# Altium project CSUEAF4.PrjPcb
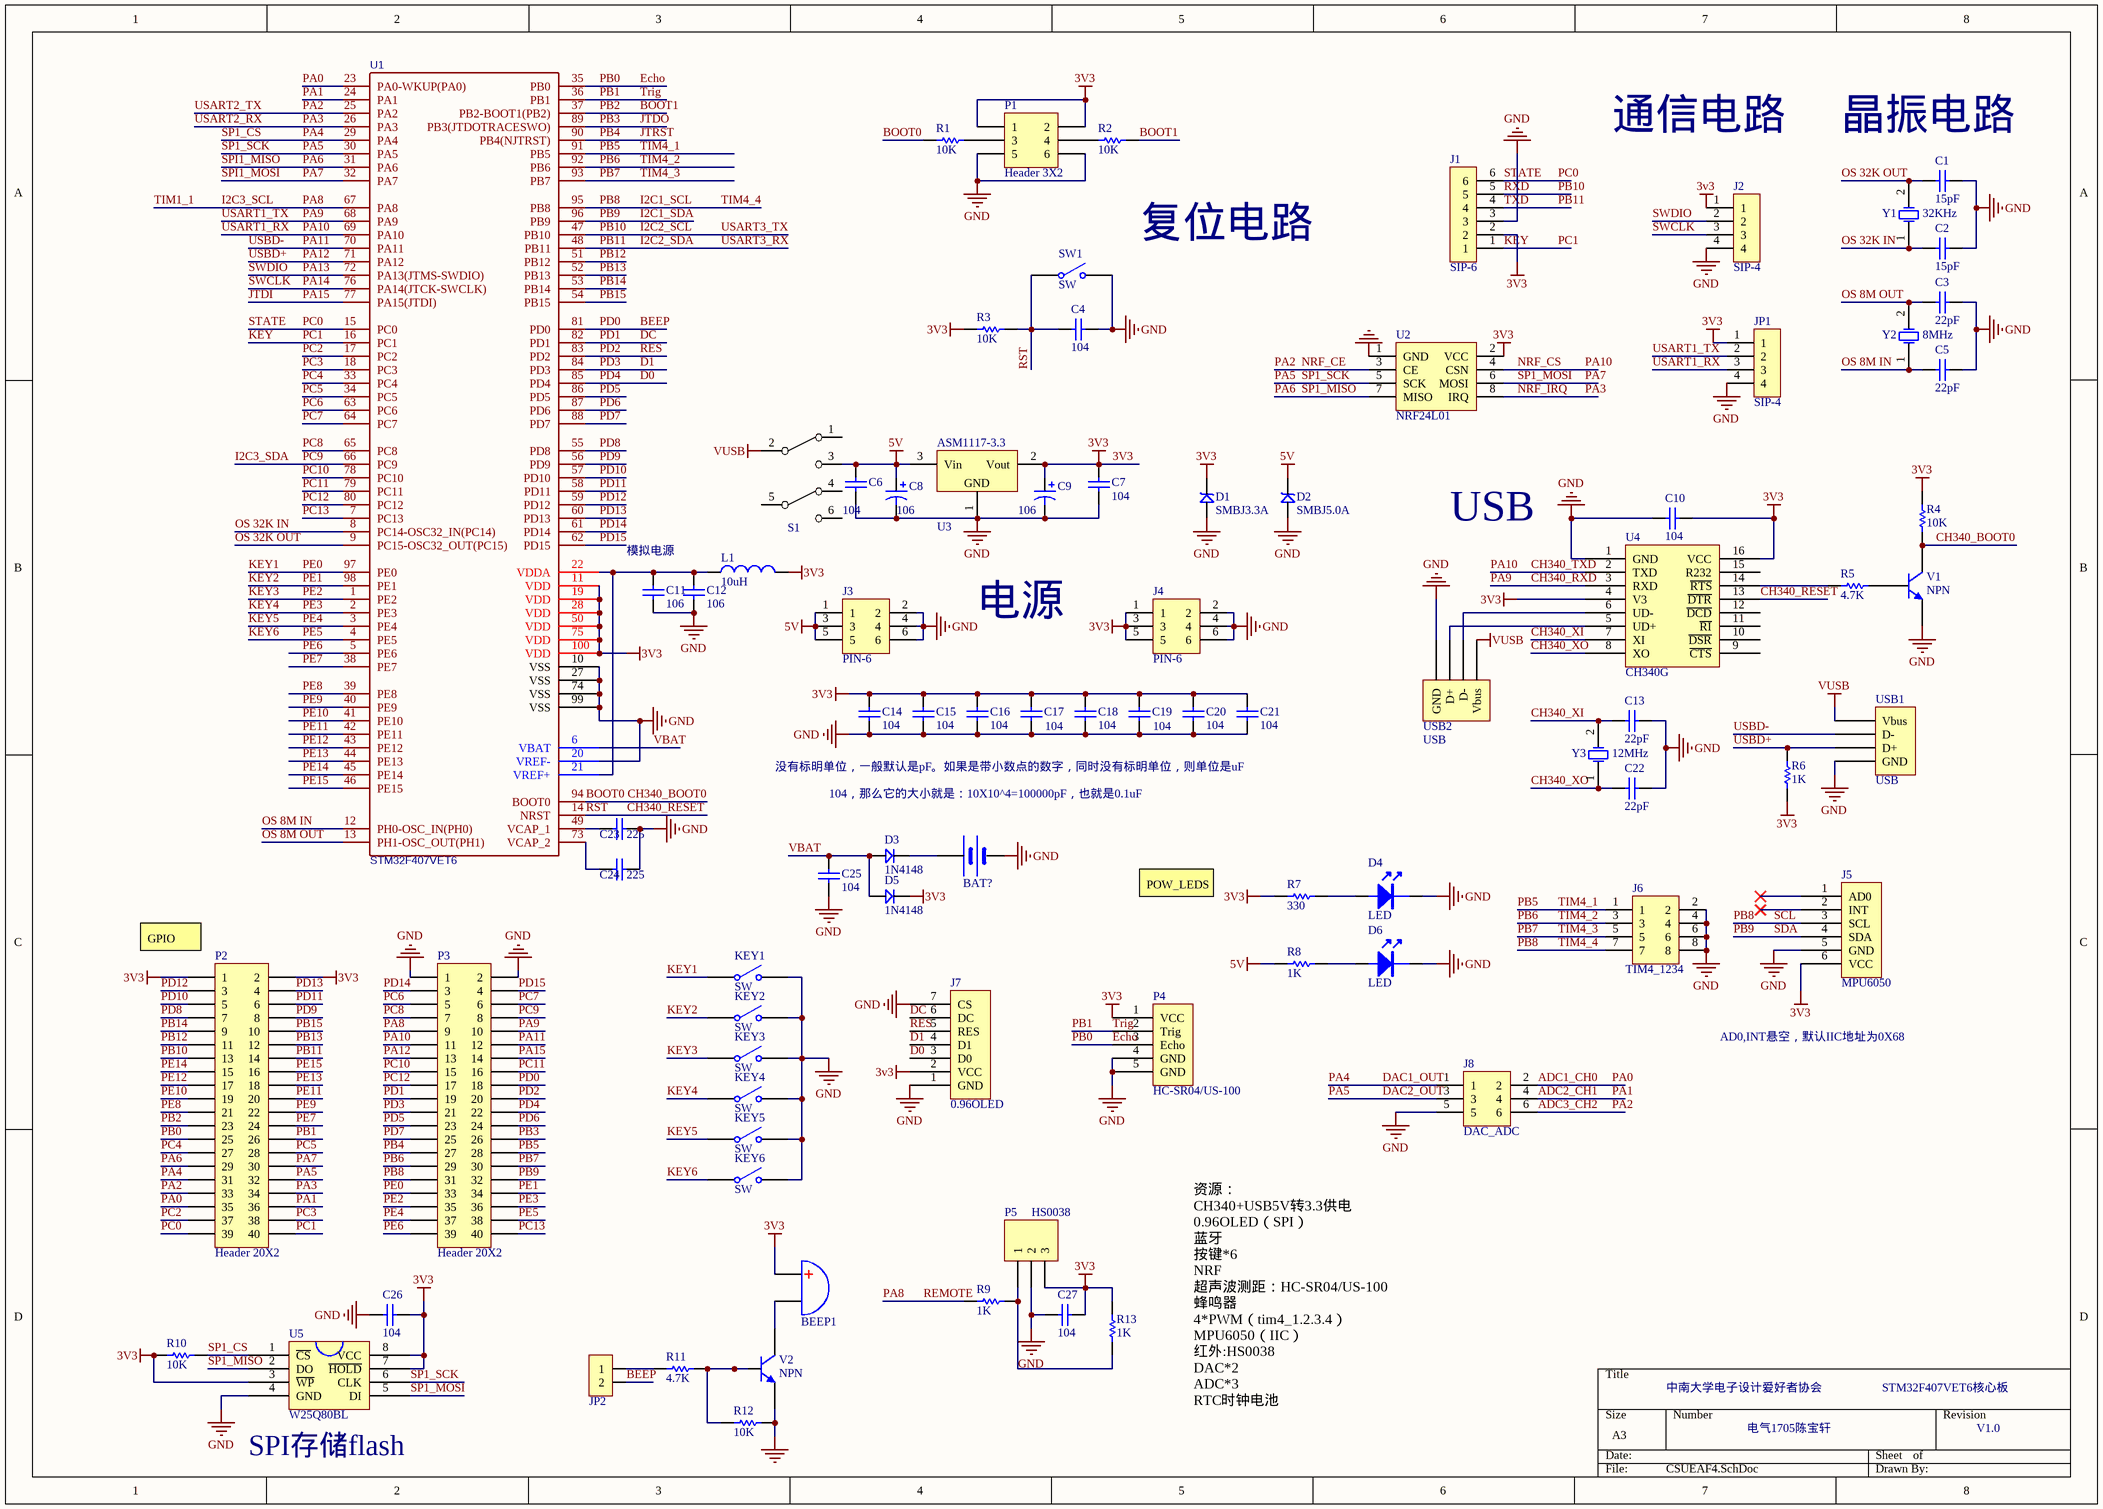
[diagram p0: CSUEAF4.SchDoc]
1 sheet, 84 parts. Net scope: global (net labels, ports and power ports of the same name join across sheets).
Board file: CSUEAF4.PcbDoc

## Sheet CSUEAF4.SchDoc
size A3

### Parts
BAT?  BATT  [BATM]  (value not drawn)
BEEP1  蜂鸣器  [蜂鸣器0905]  (value not drawn)
C1  15pF  [C0603]
C2  15pF  [C0603]
C3  22pF  [C0603]
C4  104  [C0603]
C5  22pF  [C0603]
C6  104  [C0603]
C7  104  [C0603]
C8  106  [3216-ce]
C9  106  [3216-ce]
C10  104  [C0603]
C11  106  [C0603]
C12  106  [C0603]
C13  22pF  [C0603]
C14  104  [C0603]
C15  104  [C0603]
C16  104  [C0603]
C17  104  [C0603]
C18  104  [C0603]
C19  104  [C0603]
C20  104  [C0603]
C21  104  [C0603]
C22  22pF  [C0603]
C23  225  [C0603]
C24  225  [C0603]
C25  104  [C0603]
C26  104  [C0603]
C27  104  [C0603]
D1  SMBJ3.3A  [SMBJ]
D2  SMBJ5.0A  [SMBJ]
D3  1N4148  [DO-35]
D4  LED  [LED 0603G]
D5  1N4148  [DO-35]
D6  LED  [LED 0603G]
J1  SIP-6  [2.54排针1X6]
J2  SIP-4  [2.54XH接插件4P]
J3  PIN-6  [2.54排针2X3]
J4  PIN-6  [2.54排针2X3]
J5  MPU6050  [2.54排针1X6]
J6  TIM4_1234  [2.54排针2X4]
J7  0.96OLED  [OLED 0.96-SPI _无定位孔]
J8  DAC_ADC  [2.54排针2X3]
JP1  SIP-4  [2.54排针1X4]
JP2  JX2  [SIP2]  (value not drawn)
KEY1  SW  [按键微动开关2]
KEY2  SW  [按键微动开关2]
KEY3  SW  [按键微动开关2]
KEY4  SW  [按键微动开关2]
KEY5  SW  [按键微动开关2]
KEY6  SW  [按键微动开关2]
L1  10uH  [L0603]
P1  Header 3X2  [HDR2X3]
P2  Header 20X2  [HDR2X20]
P3  Header 20X2  [HDR2X20]
P4  HC-SR04/US-100  [HDR1X5]
P5  HS0038  [HDR1X3]
R1  10K  [R0603]
R2  10K  [R0603]
R3  10K  [R0603]
R4  10K  [R0603]
R5  4.7K  [R0603]
R6  1K  [R0603]
R7  330  [R0603]
R8  1K  [R0603]
R9  1K  [R0603]
R10  10K  [R0603]
R11  4.7K  [R0603]
R12  10K  [R0603]
R13  1K  [R0603]
S1  SWITCH-6  [自锁开关5.8*5.8]  (value not drawn)
SW1  SW  [按键微动开关2]
U1  STM32F407VET6  [LQFP100]
U2  NRF24L01  [2.54排针2X4]
U3  AMS1117-3V3  [SOT223]  (value not drawn)
U4  CH340G  [SOIC16]
U5  W25Q80BL  [W25Q-SO8]
USB1  USB  [MICRO-USB-5P4脚无定位孔]
USB2  USB  [MICRO-USB-5P4脚无定位孔]
V1  NPN  [SOT-23]
V2  NPN  [SOT-23]
Y1  32KHz  [OSC-2x6-WI-B]
Y2  8MHz  [OSC-HC-49S]
Y3  12MHz  [OSC-HC-49S]

### Nets
3V3: BEEP1.1(A) C7.2 C9.1 C10.1 C14.2 C15.2 C16.2 C17.2 C18.2 C19.2 C20.2 C21.2 C26.1 C27.1 D1.2 D5.2 J1.2 J2.1 J4.1 J4.3 J4.5 J5.6(VCC) J7.2(VCC) JP1.1 L1.2 P1.1 P1.2 P2.1 P2.2 P4.1(VCC) P5.3 R3.1 R4.2 R6.1 R7.2 R10.2 R13.1 U1.11(VDD) U1.19(VDD) U1.28(VDD) U1.50(VDD) U1.75(VDD) U1.100(VDD) U2.2(VCC) U3.2(Vout) U4.4(V3) U4.16(VCC) U5.3(~{WP}) U5.7(~{HOLD}) U5.8(VCC)
5V: C6.2 C8.1 D2.2 J3.1 J3.3 J3.5 R8.2 S1.3 U3.3(Vin)
GND: BAT?.2(GND) C1.1 C2.1 C3.1 C4.1 C5.1 C6.1 C7.1 C8.2 C9.2 C10.2 C11.1 C12.1 C13.1 C14.1 C15.1 C16.1 C17.1 C18.1 C19.1 C20.1 C21.1 C22.1 C23.2 C24.2 C25.1 C26.2 C27.2 D1.1 D2.1 D4.K D6.K J1.3 J2.4 J3.2 J3.4 J3.6 J4.2 J4.4 J4.6 J5.5(GND) J6.2 J6.4 J6.6 J6.8 J7.1(GND) J7.7(CS) J8.5 JP1.4 KEY1.2(NO) KEY2.2(NO) KEY3.2(NO) KEY4.2(NO) KEY5.2(NO) KEY6.2(NO) P1.5 P1.6 P3.1 P3.2 P4.4(GND) P4.5(GND) P5.2 R12.1 SW1.2(NO) U1.10(VSS) U1.20(VREF-) U1.27(VSS) U1.74(VSS) U1.99(VSS) U2.1(GND) U3.1(GND) U4.1(GND) U5.4(GND) USB1.5(GND) USB2.5(GND) V1.2(E) V2.2(E)
VUSB: S1.2 USB1.1(Vbus) USB2.1(Vbus)
ADC1_CH0: J8.2 P2.35 U1.23(PA0-WKUP(PA0))  [also labelled PA0]
ADC2_CH1: J8.4 P2.36 U1.24(PA1)  [also labelled PA1]
ADC3_CH2: J8.6 P2.33 U1.25(PA2) U2.3(CE)  [also labelled NRF_CE, PA2, USART2_TX]
BEEP: JP2.2 P3.18 U1.81(PD0)  [also labelled PD0]
BOOT0: R1.2 R4.1 U1.94(BOOT0) V1.3(C)  [also labelled CH340_BOOT0]
BOOT1: P2.23 R2.1 U1.37(PB2-BOOT1(PB2))  [also labelled PB2]
CH340_RESET: C4.2 R3.2 SW1.1(COMMON) U1.14(NRST) U4.13(~{DTR})  [also labelled RST]
CH340_RXD: JP1.2 P3.10 U1.68(PA9) U4.3(RXD)  [also labelled PA9, USART1_TX]
CH340_TXD: JP1.3 P3.11 U1.69(PA10) U2.4(CSN) U4.2(TXD)  [also labelled NRF_CS, PA10, USART1_RX]
CH340_XI: C13.2 U4.7(XI) Y3.2(OSC2)
CH340_XO: C22.2 U4.8(XO) Y3.1(OSC1)
D0: J7.3(D0) P3.22 U1.85(PD4)  [also labelled PD4]
D1: J7.4(D1) P3.21 U1.84(PD3)  [also labelled PD3]
DAC1_OUT: J8.1 P2.31 R10.1 U1.29(PA4) U5.1(~{CS})  [also labelled PA4, SP1_CS]
DAC2_OUT: J8.3 P2.32 U1.30(PA5) U2.5(SCK) U5.6(CLK)  [also labelled PA5, SP1_SCK]
DC: J7.6(DC) P3.19 U1.82(PD1)  [also labelled PD1]
Echo: P2.25 P4.3(Echo) U1.35(PB0)  [also labelled PB0]
I2C1_SCL: J5.3(SCL) J6.7 P3.31 U1.95(PB8)  [also labelled PB8, SCL, TIM4_4]
I2C1_SDA: J5.4(SDA) P3.32 U1.96(PB9)  [also labelled PB9, SDA]
I2C2_SCL: J1.5 P2.13 U1.47(PB10)  [also labelled PB10, RXD, USART3_TX]
I2C2_SDA: J1.4 P2.14 U1.48(PB11)  [also labelled PB11, TXD, USART3_RX]
I2C3_SCL: P3.9 R9.2 U1.67(PA8)  [also labelled PA8, REMOTE, TIM1_1]
I2C3_SDA: P3.8 U1.66(PC9)  [also labelled PC9]
JTDI: P3.14 U1.77(PA15(JTDI))  [also labelled PA15]
JTDO: P3.26 U1.89(PB3(JTDOTRACESWO))  [also labelled PB3]
JTRST: P3.27 U1.90(PB4(NJTRST))  [also labelled PB4]
KEY: J1.1 P2.40 U1.16(PC1)  [also labelled PC1]
KEY1: KEY1.1(COMMON) P3.33 U1.97(PE0)  [also labelled PE0]
KEY2: KEY2.1(COMMON) P3.34 U1.98(PE1)  [also labelled PE1]
KEY3: KEY3.1(COMMON) P3.35 U1.1(PE2)  [also labelled PE2]
KEY4: KEY4.1(COMMON) P3.36 U1.2(PE3)  [also labelled PE3]
KEY5: KEY5.1(COMMON) P3.37 U1.3(PE4)  [also labelled PE4]
KEY6: KEY6.1(COMMON) P3.38 U1.4(PE5)  [also labelled PE5]
NRF_IRQ: P2.34 U1.26(PA3) U2.8(IRQ)  [also labelled PA3, USART2_RX]
OS 8M IN: C5.2 U1.12(PH0-OSC_IN(PH0)) Y2.1(OSC1)
OS 8M OUT: C3.2 U1.13(PH1-OSC_OUT(PH1)) Y2.2(OSC2)
OS 32K IN: C2.2 U1.8(PC14-OSC32_IN(PC14)) Y1.1(OSC1)
OS 32K OUT: C1.2 U1.9(PC15-OSC32_OUT(PC15)) Y1.2(OSC2)
PA6: P2.29 U1.31(PA6) U2.7(MISO) U5.2(DO)  [also labelled SP1_MISO, SPI1_MISO]
PA7: P2.30 U1.32(PA7) U2.6(MOSI) U5.5(DI)  [also labelled SP1_MOSI, SPI1_MOSI]
PA11: P3.12 U1.70(PA11) USB1.2(D-)  [also labelled USBD-]
PA12: P3.13 R6.2 U1.71(PA12) USB1.3(D+)  [also labelled USBD+]
PA13: J2.2 U1.72(PA13(JTMS-SWDIO))  [also labelled SWDIO]
PA14: J2.3 U1.76(PA14(JTCK-SWCLK))  [also labelled SWCLK]
PB1: P2.26 P4.2(Trig) U1.36(PB1)  [also labelled Trig]
PB5: J6.1 P3.28 U1.91(PB5)  [also labelled TIM4_1]
PB6: J6.3 P3.29 U1.92(PB6)  [also labelled TIM4_2]
PB7: J6.5 P3.30 U1.93(PB7)  [also labelled TIM4_3]
PB12: P2.11 U1.51(PB12)
PB13: P2.12 U1.52(PB13)
PB14: P2.9 U1.53(PB14)
PB15: P2.10 U1.54(PB15)
PC0: J1.6 P2.39 U1.15(PC0)  [also labelled STATE]
PC2: P2.37 U1.17(PC2)
PC3: P2.38 U1.18(PC3)
PC4: P2.27 U1.33(PC4)
PC5: P2.28 U1.34(PC5)
PC6: P3.5 U1.63(PC6)
PC7: P3.6 U1.64(PC7)
PC8: P3.7 U1.65(PC8)
PC10: P3.15 U1.78(PC10)
PC11: P3.16 U1.79(PC11)
PC12: P3.17 U1.80(PC12)
PC13: P3.40 U1.7(PC13)
PD2: J7.5(RES) P3.20 U1.83(PD2)  [also labelled RES]
PD5: P3.23 U1.86(PD5)
PD6: P3.24 U1.87(PD6)
PD7: P3.25 U1.88(PD7)
PD8: P2.7 U1.55(PD8)
PD9: P2.8 U1.56(PD9)
PD10: P2.5 U1.57(PD10)
PD11: P2.6 U1.58(PD11)
PD12: P2.3 U1.59(PD12)
PD13: P2.4 U1.60(PD13)
PD14: P3.3 U1.61(PD14)
PD15: P3.4 U1.62(PD15)
PE6: P3.39 U1.5(PE6)
PE7: P2.24 U1.38(PE7)
PE8: P2.21 U1.39(PE8)
PE9: P2.22 U1.40(PE9)
PE10: P2.19 U1.41(PE10)
PE11: P2.20 U1.42(PE11)
PE12: P2.17 U1.43(PE12)
PE13: P2.18 U1.44(PE13)
PE14: P2.15 U1.45(PE14)
PE15: P2.16 U1.46(PE15)
VBAT: C25.2 D3.1 D5.1 U1.6(VBAT)
NetBAT?_1: BAT?.1(VCC) D3.2
NetBEEP1_2: BEEP1.2(B) V2.3(C)
NetC11_2: C11.2 C12.2 L1.1 U1.21(VREF+) U1.22(VDDA)
NetC23_1: C23.1 U1.49(VCAP_1)
NetC24_1: C24.1 U1.73(VCAP_2)
NetD4_A: D4.A R7.1
NetD6_A: D6.A R8.1
NetJP2_1: JP2.1 R11.1
NetP1_3: P1.3 R1.1
NetP1_4: P1.4 R2.2
NetP5_1: P5.1 R9.1 R13.2
NetR5_1: R5.1 V1.1(B)
NetR5_2: R5.2 U4.14(~{RTS})
NetR11_2: R11.2 R12.2 V2.1(B)
NetU4_5: U4.5(UD+) USB2.3(D+)
NetU4_6: U4.6(UD-) USB2.2(D-)

Not connected (* = marked no-connect by the designer): J5 1(AD0)* 2(INT)*; S1 1 4 5 6; U4 9(~{CTS}) 10(~{DSR}) 11(~{RI}) 12(~{DCD}) 15(R232)

### Notes on the sheet
- 通信电路
- (near C1) 晶振电路
- 复位电路
- (near U3) ASM1117-3.3
- (near C11) 模拟电源
- USB
- 电源
- 没有标明单位，一般默认是pF。如果是带小数点的数字，同时没有标明单位，则单位是uF
- 104，那么它的大小就是：10X10^4=100000pF，也就是0.1uF
- POW_LEDS
- (near P2) GPIO
- AD0,INT悬空，默认IIC地址为0X68
- 中南大学电子设计爱好者协会
- STM32F407VET6核心板
- (near U5) SPI存储flash
- 资源：
  CH340+USB5V转3.3供电
  0.96OLED（SPI）
  蓝牙
  按键*6
  NRF
  超声波测距：HC-SR04/US-100
  蜂鸣器
  4*PWM（tim4_1.2.3.4）
  MPU6050（IIC）
  红外:HS0038
  DAC*2
  ADC*3
  RTC时钟电池
- 电气1705陈宝轩
- V1.0

### Library data of the parts
BAT? = BAT
C1 C2 C4 C6 C7 C10-C12 C14-C21 C23-C27 = 电容: Capacitor; Value: 22pF; Published: 8-Jun-2000; LatestRevisionDate: 17-Jul-2002; LatestRevisionNote: Re-released for DXP Platform.; PackageReference: RAD-0.3; Publisher: Altium Limited; PackageDescription: Radial Cap, Thru-Hole; 2 Leads; 0.3 in Pin Spacing
C3 C5 C13 C22 = 电容: Capacitor; Published: 8-Jun-2000; LatestRevisionDate: 17-Jul-2002; LatestRevisionNote: Re-released for DXP Platform.; PackageReference: RAD-0.3; Publisher: Altium Limited; PackageDescription: Radial Cap, Thru-Hole; 2 Leads; 0.3 in Pin Spacing; Value: 22pF
C8 C9 = 电解电容: Polarized Capacitor (Axial); Value: 100pF; Published: 8-Jun-2000; LatestRevisionDate: 17-Jul-2002; LatestRevisionNote: Re-released for DXP Platform.; PackageReference: POLAR0.8; Publisher: Altium Limited; PackageDescription: Polarized Capacitor; 2 Leads
D1 D2 = SMBJ: TVS
D3 D5 = 1N4148: 开关二极管
J6 = PIN-8
J7 = OLED_SPI
J8 = PIN-6
JP2 = JX2: Connector
KEY1-KEY6 SW1 = Switch: Single-Pole, Single-Throw Switch
L1 = 磁珠
P1 = Header 3X2: Header, 3-Pin, Dual row; LatestRevisionDate: 17-Jul-2002; LatestRevisionNote: Re-released for DXP Platform.; Publisher: Altium Limited
P2 P3 = Header 20X2: Header, 20-Pin, Dual row; LatestRevisionDate: 17-Jul-2002; LatestRevisionNote: Re-released for DXP Platform.; Publisher: Altium Limited
P4 = HC-SR04/US-100: 超声波测距模块
P5 = Header 3: Header, 3-Pin; LatestRevisionDate: 17-Jul-2002; LatestRevisionNote: Re-released for DXP Platform.; Publisher: Altium Limited
R1-R13 = 电阻: Resistor; Value: 150R; Published: 8-Jun-2000; LatestRevisionDate: 17-Jul-2002; LatestRevisionNote: Re-released for DXP Platform.; PackageReference: AXIAL-0.3; Publisher: Altium Limited; PackageDescription: Axial Device, Thru-Hole; 2 Leads; 0.3 in Pin Spacing
S1 = SWITCH-6: 自锁开关
U1 = STM32F407VET6: BOM_Manufacturer: STMicroelectronics; SMT Type: Basic; BOM_Supplier: LCSC; BOM_Manufacturer Part: STM32F407VET6; BOM_LCSC Assembly: Yes; image: //image.lceda.cn/szlcsc/C28730.jpg; BOM_Supplier Part: C28730; spicePre: U
U2 = NRF24L01: NRF24L01模块排母
U3 = 三端稳压: 三端稳压芯片; BOM名称: 稳压芯片; 版权归属: 源创客; 学习资源: www.ooocke.com
V1 V2 = NPN: NPN Bipolar Transistor; Published: 8-Jun-2000; LatestRevisionDate: 17-Jul-2002; LatestRevisionNote: Re-released for DXP Platform.; PackageReference: TO-226-AA; Publisher: Altium Limited; PackageDescription: TO, Flat Index; 3 In-Line, Axial Leads; Body Dia. 4.8mm; Leads 0.55 x 0.51 mm (max); Code_JEDEC: TO-226-AA
Y1-Y3 = XTAL: Crystal Oscillator; Published: 8-Jun-2000; LatestRevisionDate: 17-Jul-2002; LatestRevisionNote: Re-released for DXP Platform.; PackageReference: R38; Publisher: Altium Limited; PackageDescription: Crystal, Thru-Hole; 2 Leads; Body 3.1 x 8.2 mm (Dia.xH)